# EAGLE design Adafruit Flora TCS34725 (EAGLE 6.3)
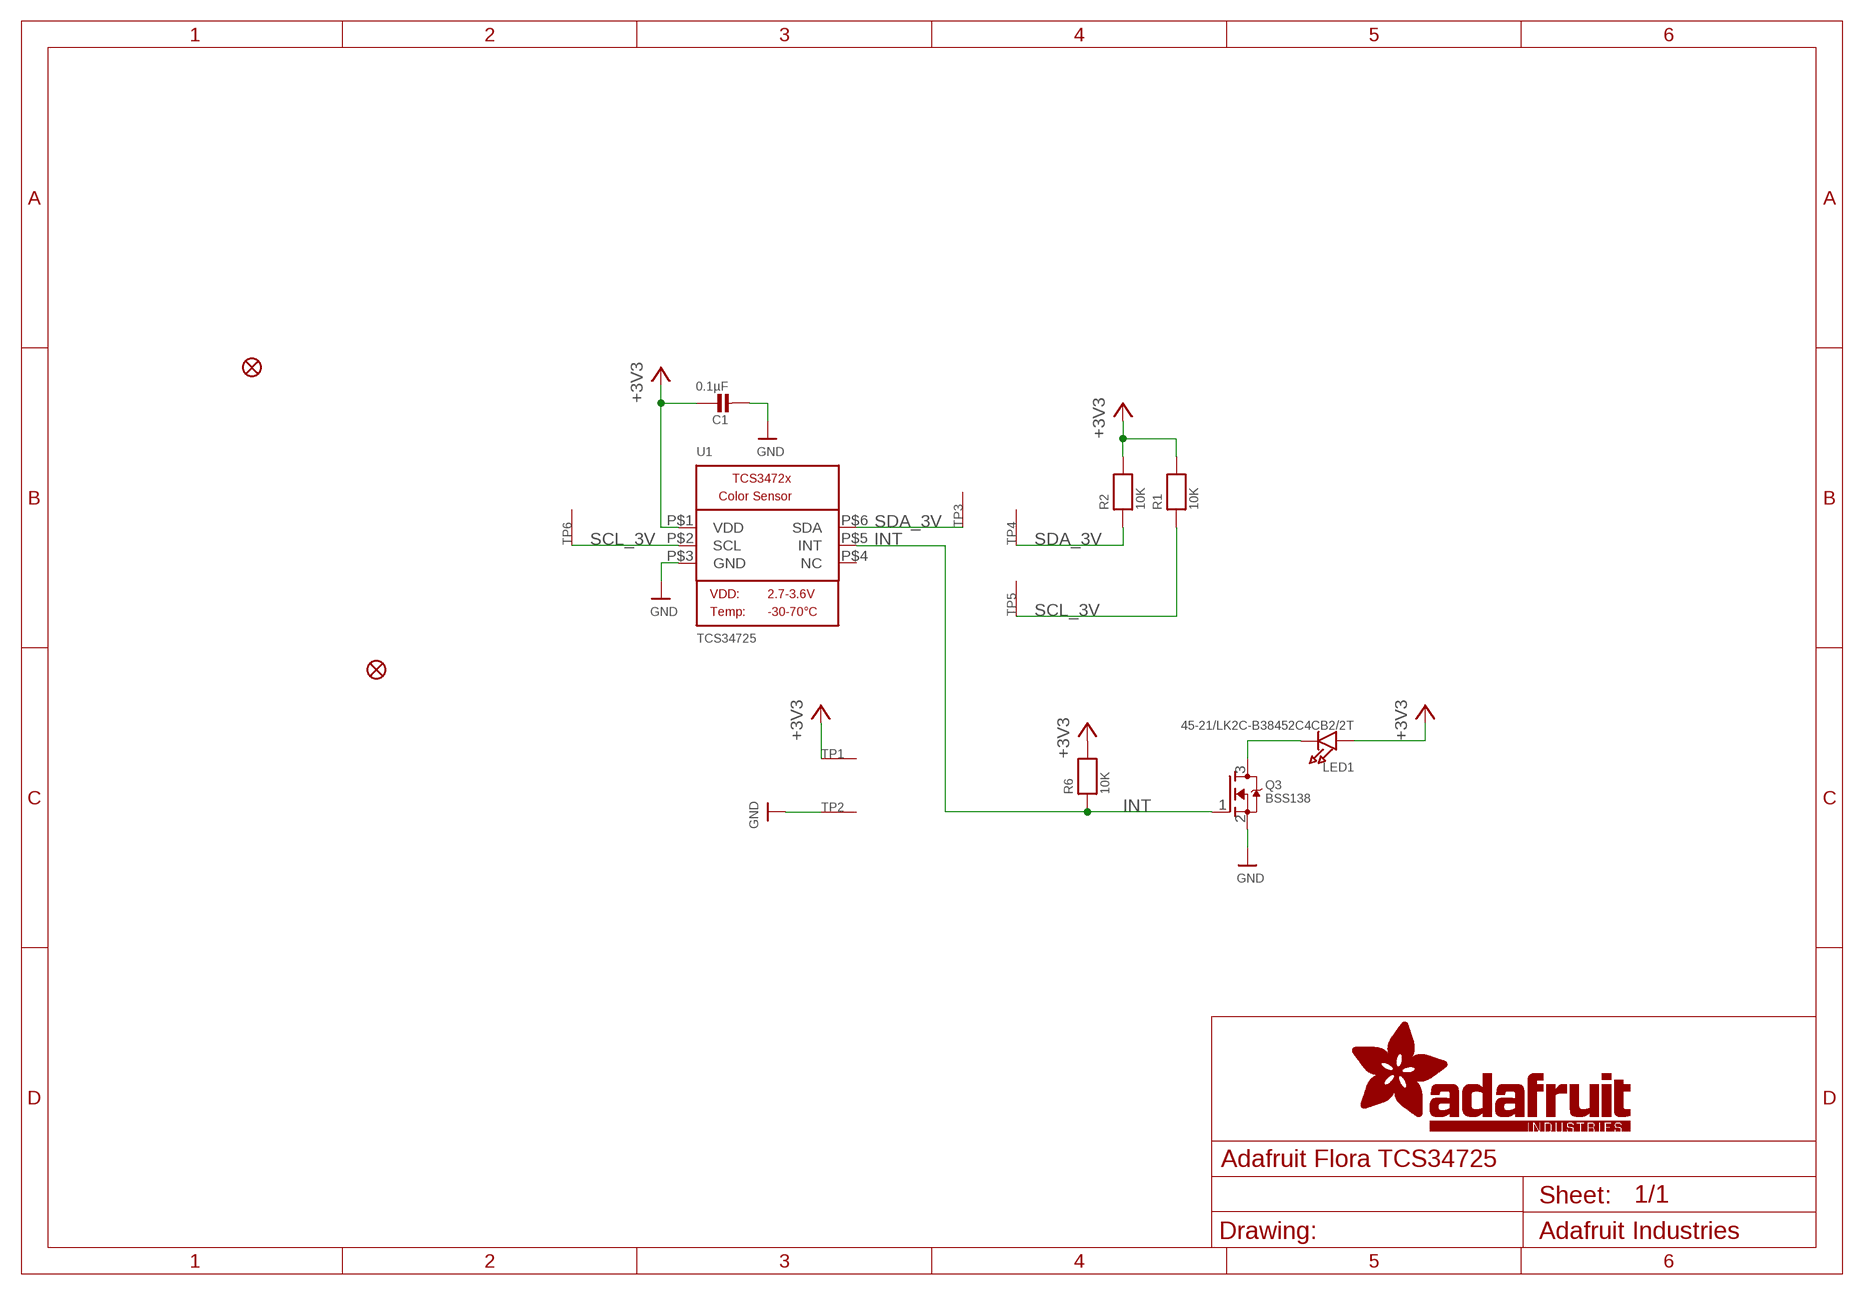
[diagram p0: schematic, sheet 1]

## Parts
C1  0.1µF  CAP_CERAMIC_0805  [_0805]
FID1  FIDUCIAL""  [FIDUCIAL_1MM]
FID2  FIDUCIAL""  [FIDUCIAL_1MM]
LED1  45-21/LK2C-B38452C4CB2/2T  LEDEV45-21  [EVERLIGHT_45-21]
Q3  BSS138  MOSFET-NWIDE  [SOT23-WIDE]
R1  10K  RESISTOR_0805  [_0805]
R2  10K  RESISTOR_0805  [_0805]
R6  10K  RESISTOR_0805  [_0805]
TP1  SEWTAP0.5IN  [SEWINGTAP_0.5]
TP2  SEWTAP0.5IN  [SEWINGTAP_0.5]
TP3  SEWTAP0.5IN  [SEWINGTAP_0.5]
TP4  SEWTAP0.5IN  [SEWINGTAP_0.5]
TP5  SEWTAP0.5IN  [SEWINGTAP_0.5]
TP6  SEWTAP0.5IN  [SEWINGTAP_0.5]
U1  TCS34725  LIGHT_TCS3472  [TCS3472_FN6]

## Nets
+3V3: C1.1 LED1.A R1.2 R2.2 R6.2 TP1.TAP(SEW) U1.P$1(VDD)
GND: C1.2 Q3.2(S) TP2.TAP(SEW) U1.P$3(GND)
INT: Q3.1(G) R6.1 U1.P$5(INT)
N$1: LED1.K(C) Q3.3(D)
SCL_3V: R1.1 TP5.TAP(SEW) TP6.TAP(SEW) U1.P$2(SCL)
SDA_3V: R2.1 TP3.TAP(SEW) TP4.TAP(SEW) U1.P$6(SDA)
Unconnected: U1.P$4(NC)

## Library data of the parts
C1 = microbuilder:CAP_CERAMIC: Ceramic Capacitors For new designs, use the packages preceded by an '_' character since they are more reliable: The following footprints should be used on most boards: _0402 - Standard footprint for regular board layouts _0603 - Standard footprint for regular board layouts _0805 - Standard footprint for regular board layouts For extremely tight-pitch boards where space is at a premium, the following 'micro-pitch' footprints can be used (smaller pads, no silkscreen outline, etc.): _0402MP - Micro-pitch footprint for very dense/compact boards _0603MP - Micro-pitch footprint for very dense/compact boards _0805MP - Micro-pitch footprint for very dense/compact boards Commonly Stocked Parts 0402 - 0402 Surface Mount Capacitors 16pF 50V 5% [Digikey: 445-4899-2-ND] 18pF 50V 5% [Digikey: 490-1281-2-ND] 22pF 50V 5% [Digikey: 490-1283-2-ND] 68pF 50V 5% [Digikey: 490-1289-2-ND] 0.1uF 10V 10% [Digikey: 490-1318-2-ND] 1.0uF 6.3V 10% [Digikey: 490-1320-2-ND] 0603 - 0603 Surface Mount Capacitors 16 pF 50V 5% [Digikey: 445-5051-2-ND] 22 pF 50V [Digikey: PCC220ACVTR-ND] 33 pF 50V 5% [Digikey: 490-1415-1-ND] 56pF 50V 5% [Digikey: 490-1421-1-ND] 220pF 50V 5% [Digikey: 445-1285-1-ND] 680 pF 50V 2200 pF 50V 5% C0G [Digikey: 445-1297-1-ND] 5600 pF 100V 5% X7R [Digikey: 478-3711-1-ND] 0.1 µF 25V 10% [Digikey: PCC2277TR-ND] 0.22 µF 16V 10% X7R [Digikey: 445-1318-1-ND] 1.0 µF 25V 10% [Digikey: 445-5146-2-ND] 0603 - RF Specific 3pF 250V +/-0.1pF RF [Digikey: 712-1347-1-ND] 18 pF 250V 5% [Digikey: 478-3505-1-ND or 712-1322-1-ND] 56 pF 250V 5% C0G RF [Digikey: 490-4867-1-ND] 68 pF 250V RF [Digikey: 490-4868-1-ND] 0805 - 0805 Surface Mount Capacitors 220 pF 250V 2% RF Ceramic Capacitor [Digikey: 712-1398-1-ND] 1000 pF 50V 2% NP0 Ceramic Capacitor [Digikey: 478-3760-1-ND] 0.1 µF 25V 10% Ceramic Capacitor [Digikey: PCC1828TR-ND] 1.0 µF 16V 10% Ceramic Capacitor[Digikey: 490-1691-2-ND] 10.0 µF 10V 10% Ceramic Capacitor[Digikey: 709-1228-1-ND] 10.0 uF 16V 10% Ceramic Capacitor [Digikey: 478-5165-2-ND] 47 uF 6.3V 20% Ceramic Capacitor [Digikey: 587-1779-1-ND or 399-5506-1-ND] 1206 - 1206 Surface Mount Capacitors 47uF 10V 20% Ceramic Capacitor [Digikey: 490-5528-1-ND or 399-5508-1-ND or 445-6010-1-ND] 100uF 6.3V -20%, +80% Y5V Ceramic Capacitor (Digikey: 490-4512-1-ND, Mouser: 81-GRM31CF50J107ZE1L)
FID1 FID2 = microbuilder:FIDUCIAL: Fiducial Alignment Points Various fiducial points for machine vision alignment.; BOM: EXCLUDE
LED1 = microbuilder:LED: LED 0603 - 0603 Surface Mount Package 2mA: Green LED - Low Power (3.9mcd, 2ma, 1.7Vf) - Digikey: 475-2709-2-ND Orange LED - Low Power (9.8mcd, 2ma, 1.8Vf) - Digikey: 475-1194-2-ND Red LED - Low Power (5mcd, 2ma, 1.8Vf) - Digikey: 475-1195-2-ND Yellow LED - Low Power (7mcd, 2ma, 1.8Vf) - Digikey: 475-1196-2-ND 5mA: Blue LED - Low Power (17mcd, 5ma, 2.9Vf) - Digikey: LNJ937W8CRACT-ND 0805 - 0805 Surface Mount Package 2mA: Red LED (8.8mcd, 2mA, 1.8Vf, Clear) - Low Power [Digikey: 475-2510-1-ND] Green LED (5mcd, 2mA, 1.8Vf, Clear) - Low Power [Digikey: 475-2730-1-ND] Yellow LED (11.3mcd, 2mA, 1.8Vf, Clear) - Low Power [Digikey: 475-2555-1-ND] 20mA: Red LED (104mcd, 20mA, Diffused) - LS R976 [Digikey: 475-1278-6-ND] Red LED (12mcd, 20mA, 2.0Vf, Clear) - APT2012EC [Digikey: 754-1128-1-ND] Green LED (15mcd, 20mA, 2.2Vf, Clear) - APT2012GC [Digikey: 754-1131-1-ND] Orange LED (160mcd, 20mA, 2.1Vf, Clear) - APT2012SECK [Digikey: 754-1130-1-ND] 1206 - 1206 Surface Mount Package Green LED (26mcd, 20mA, Diffused) - LG N971 [Digikey: 475-1407-6-ND] Red LED (15mcd, 20mA, Diffused) - LH N974 [Digikey: 475-1416-6-ND] Cree - Cree High-Power Surface Mount LEDs XPEBWT-L1-0000-00D50 - White 111lm 350mA 2.9Vf 6200K 110° XTEAWT-00-0000-00000LEE3 - White 114lm 350mA 2.85Vf 5000K 115° Everlight - Everlight 45-21 Series Surface Mount LEDs 45-21/QK2C-B2832AC2CB2/2T - Warm White 2000mcd 20mA 3.25Vf 3050K 120° 45-21/LK2C-B38452C4CB2/2T - Nuetral White 2000mcd 20mA 3.25Vf 4150K 120° 45-21/LK2C-B50634C6CB2/2T - Cold White 2200mcd 20mA 3.25Vf 5650K 120° PLCC2 Reverse Mount LS T77K-J1L2-1-0-2-R18-Z - Red 11.25mcd 2mA 1.8Vf 630nm 120° LO T77K-L1M2-24-Z - Orange 19.6mcd 2mA 1.8Vf 606nm 120° LY T77K-K2M1-26-Z - Yellow 15.7mcd 2mA 1.8Vf 587nm 120°
Q3 = microbuilder:MOSFET-N: N-Channel Mosfet LEGEND VDS: Voltage Drain-Source ID: Drain Current RDS(ON): Drain-Source On-State Resistance VGS(TH): Gate-Source Threshold Voltage CISS: Drain-Source Input Capacitance SOT-23 Name VDS ID RDS(ON) VGS(TH) CISS Order Number 2N7002E 60V 260mA 2.5 Ohm 2.5V @ 250uA 26.7pF @ 25V 2N7002ET1GOSTR-ND BSH103 30V 850mA 400 mOhm 400mV @ 1mA 83pF @ 24V BSH103,235-ND BSS138 60V 320mA 1.6 Ohm 1.5V @ 250uA 50pF @ 10V Mouser: 771-BSS138PW115 DMN2075U-7 20V 4.2A 38 mOhm 1V @ 250 uA 594.3pF @ 10V DMN2075U-7DICT-ND * BSS138 good choice for I2C level-shifting
R1 R2 R6 = microbuilder:RESISTOR: Resistors For new designs, use the packages preceded by an '_' character since they are more reliable: The following footprints should be used on most boards: _0402 - Standard footprint for regular board layouts _0603 - Standard footprint for regular board layouts _0805 - Standard footprint for regular board layouts For extremely tight-pitch boards where space is at a premium, the following 'micro-pitch' footprints can be used (smaller pads, no silkscreen outline, etc.): _0402MP - Micro-pitch footprint for very dense/compact boards _0603MP - Micro-pitch footprint for very dense/compact boards _0805MP - Micro-pitch footprint for very dense/compact boards
TP1-TP6 = adafruit:SEWTAP
U1 = microbuilder:LIGHT_TCS3472: TCS3472 RGB + Clear Color Sensor VDD: 2.7-3.6V Temp: -30 - 70°C IR light blocking filter 3,800,000:1 Dynamic Range 2.5µA sleep state Part IDs TCS34725: I2C bus logic = VDD, I2C address: 0x29 TCS34727: I2C bus logic = 1.8V, I2C address: 0x29

## Board
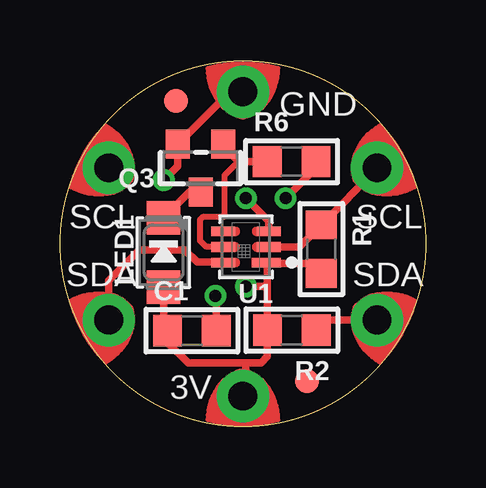
[diagram p1: board, top side]
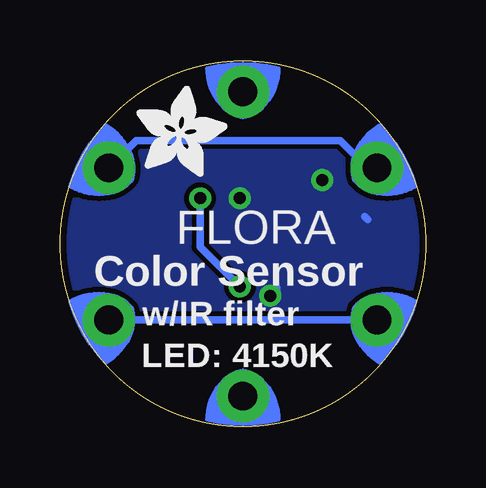
[diagram p2: board, bottom side, seen from below]

Size 15.24 x 15.24 mm. Coordinates in mm from the lower left corner, seen from the top.
Outline: circle at 7.62,7.62 radius 7.62
Copper layers (1*16): Top 0.035mm / dielectric 1.5mm / Bottom 0.035mm
Design rules "default": minimum track width 8mil, minimum drill 16mil, track to track 8mil, track to pad 8mil, pad to pad 8mil, via to via 8mil, smd to smd 8mil, copper to edge 10mil, drill to drill 8mil, minimum pad ring 10mil, minimum via ring 8mil, stop-mask expansion 4mil, vias tented up to drill 20mil, thermal gap 10mil

### Footprints (pad centres in the part's own frame; a part is rotated, then mirrored left to right if it is on the bottom)
_0805 = smd 1.2 x 1.3: 1 -1.016,0; 2 1.016,0
FIDUCIAL_1MM = smd 1 x 1: 1 0,0
EVERLIGHT_45-21 = smd 1.4 x 1.4: A -1.45,0; K 1.45,0
SOT23-WIDE = smd 1 x 1.2: 1 -0.95,-1; 2 0.95,-1; 3 0,1
SEWINGTAP_0.5 = drill 1.2 pad 2.184: TAP 0,0
TCS3472_FN6 = smd 1.2 x 0.4: P$1 -0.85,0.65 | smd 1 x 0.4: P$2 -0.95,0; P$3 -0.95,-0.65; P$4 0.95,-0.65; P$5 0.95,0; P$6 0.95,0.65

### Placement (x,y rotation side)
C1  5.5,4 0 top
FID1  4.83,13.59 0 top
FID2  10.29,1.91 0 top
LED1  4.32,7.26 90 top
Q3  5.86,10.79 180 top
R1  10.89,7.4 270 top
R2  9.66,4.02 180 top
R6  9.65,11.05 0 top
TP1  7.62,1.27 180 top
TP2  7.62,13.97 0 top
TP3  2.03,4.45 120 top
TP4  13.21,4.45 240 top
TP5  2.03,10.79 60 top
TP6  13.21,10.79 300 top
U1  7.75,7.49 180 top
U$8  [ADAFRUIT_3.5MM]  12.07,10.41 0 bottom

### Tracks (layer width: path | path; a pad name or v marks a point on that pad's centre or on a via)
+3V3  (via drill 0.5)
  Top 0.305: LED1.A 4.32,4.17 C1.1 4.48,3.52 5.33,2.67 7.75,2.67 | U1.P$1 8.64,6.8 | 8.64,6.8 8.64,5.97 | 8.64,5.97 R2.2 8.64,2.93 8.38,2.67 7.75,2.67 | 8.64,6.8 10.48,6.8 R1.2 | R6.2 10.67,10.79 v9.4,9.53 | 11.05,6.22 R1.2 | TP1.TAP 7.75,1.27 7.75,2.67 | 11.34,6.38 R1.2 | v7.75,5.84 8.52,5.84 8.64,5.97
  Bottom 0.305: v9.4,9.53 9.4,7.49 v7.75,5.84
GND  (via drill 0.5)
  Top 0.254: 4.91,11.26 4.91,11.38
  Top 0.305: U1.P$3 8.7,8.57 v7.75,9.53 | C1.2 6.51,5.46 v6.48,5.46 | 4.91,11.38 Q3.2 7.09,13.97 TP2.TAP | 4.91,11.26 4.91,10.88 v4.32,10.29
  Bottom 0.305: 7.75,13.97 TP2.TAP | v6.48,5.46 arc-90 6.22,5.84 | 2.54,8.76 2.41,8.64
  pour Bottom: 7.62,15.11 arc-90 15.11,7.24 15.11,6.22 arc-90 7.62,-0.13 arc-90 -0.13,7.62 -0.13,8 arc-90 7.49,14.99
INT
  Top 0.254: U1.P$5 6.1,7.49 5.84,7.75 5.84,8.64 5.97,8.76 6.86,8.76 6.86,10.49 7.42,11.05
  Top 0.305: Q3.1 7.42,11.05 R6.1
N$1
  Top 0.305: LED1.K 5.39,9.79 Q3.3
SCL_3V
  Top 0.305: U1.P$2 9.97,7.49 R1.1 | R1.1 | R1.1 13.21,10.73 TP6.TAP
  Bottom 0.305: TP5.TAP 2.41,10.79 3.56,11.94 12.07,11.94 TP6.TAP
SDA_3V
  Top 0.305: TP3.TAP 2.03,6.1 3.3,7.37 5.21,7.37 5.71,6.86 6.78,6.86 U1.P$6 | R2.1 11.1,4.45 TP4.TAP
  Bottom 0.305: TP3.TAP TP4.TAP

### Text on the board
tPlace: GND | SCL | SCL | SDA | SDA | 3V
bPlace: FLORA | Color Sensor | w/IR filter | LED: 4150K